# EAGLE design steering_wheel (EAGLE 5.06)
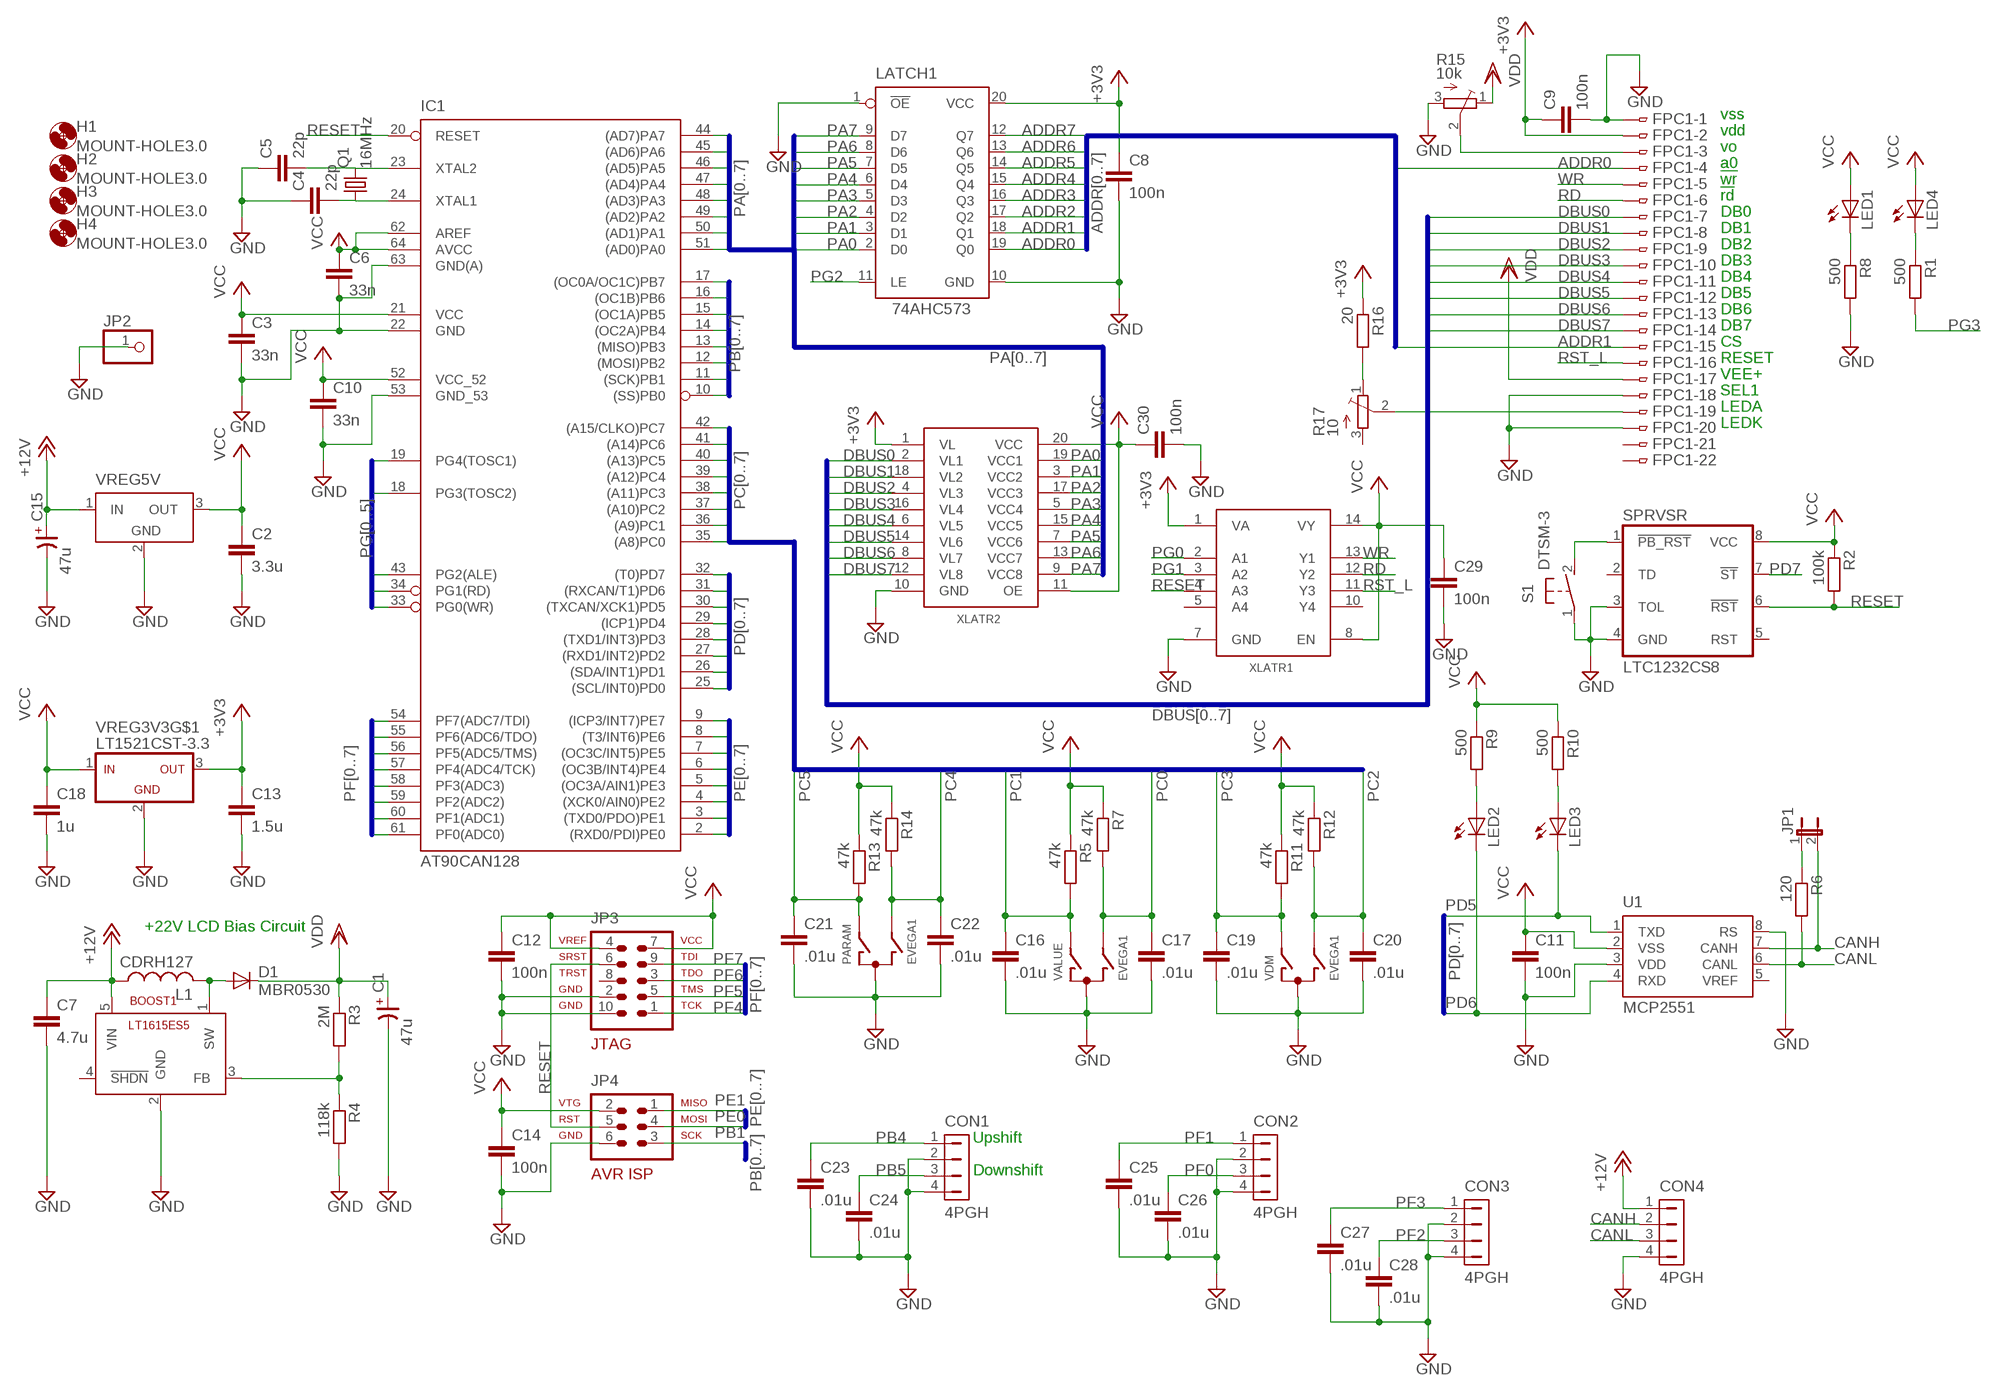
[diagram p0: schematic, sheet 1]

## Parts
BOOST1  LT1615ES5  [SOT23-5]
C1  47u  CP-SV-E/F  [SV-E/F]
C2  3.3u  C-EUC1206  [C1206]
C3  33n  C-EUC1206  [C1206]
C4  22p  C-EUC1206  [C1206]
C5  22p  C-EUC1206  [C1206]
C6  33n  C-EUC1206  [C1206]
C7  4.7u  C-EUC1206  [C1206]
C8  100n  C-EUC1206  [C1206]
C9  100n  C-EUC1206  [C1206]
C10  33n  C-EUC1206  [C1206]
C11  100n  C-EUC1206  [C1206]
C12  100n  C-EUC1206  [C1206]
C13  1.5u  C-EUC1206  [C1206]
C14  100n  C-EUC1206  [C1206]
C15  47u  CP-SV-E/F  [SV-E/F]
C16  .01u  C-EUC1206  [C1206]
C17  .01u  C-EUC1206  [C1206]
C18  1u  C-EUC1206  [C1206]
C19  .01u  C-EUC1206  [C1206]
C20  .01u  C-EUC1206  [C1206]
C21  .01u  C-EUC1206  [C1206]
C22  .01u  C-EUC1206  [C1206]
C23  .01u  C-EUC1206  [C1206]
C24  .01u  C-EUC1206  [C1206]
C25  .01u  C-EUC1206  [C1206]
C26  .01u  C-EUC1206  [C1206]
C27  .01u  C-EUC1206  [C1206]
C28  .01u  C-EUC1206  [C1206]
C29  100n  C-EUC1206  [C1206]
C30  100n  C-EUC1206  [C1206]
CON1  4PGH  [GH-CON-SIDE]
CON2  4PGH  [GH-CON-SIDE]
CON3  4PGH  [GH-CON-SIDE]
CON4  4PGH  [GH-CON-SIDE]
D1  MBR0530  DIODE-SOD123  [SOD123]
FPC1  FH12-22S-1SH(55)  [FH12-22S-1SH(56)]
H1  MOUNT-HOLE3.0  [3,0]
H2  MOUNT-HOLE3.0  [3,0]
H3  MOUNT-HOLE3.0  [3,0]
H4  MOUNT-HOLE3.0  [3,0]
IC1  AT90CAN128  [TQFP64]
JP1  JP1E  [JP1]
JP2  PINHD-1X1  [1X01]
JP3  AVR-JTAG-10  [AVR-JTAG-10]
JP4  AVR-ISP-6  [AVR-ISP-6]
L1  CDRH127  [CDRH127]
LATCH1  74AHC573  [SO20W]
LED1  LEDCHIPLED_1206  [CHIPLED_1206]
LED2  LEDCHIPLED_1206  [CHIPLED_1206]
LED3  LEDCHIPLED_1206  [CHIPLED_1206]
LED4  LEDCHIPLED_1206  [CHIPLED_1206]
PARAM  EVEGA1  [EVEGA1]
Q1  16MHz  CRYSTALHC49UP  [HC49UP]
R1  500  R-EU_R1206  [R1206]
R2  100k  R-EU_R1206  [R1206]
R3  2M  R-EU_R1206  [R1206]
R4  118k  R-EU_R1206  [R1206]
R5  47k  R-EU_R1206  [R1206]
R6  120  R-EU_R1206  [R1206]
R7  47k  R-EU_R1206  [R1206]
R8  500  R-EU_R1206  [R1206]
R9  500  R-EU_R1206  [R1206]
R10  500  R-EU_R1206  [R1206]
R11  47k  R-EU_R1206  [R1206]
R12  47k  R-EU_R1206  [R1206]
R13  47k  R-EU_R1206  [R1206]
R14  47k  R-EU_R1206  [R1206]
R15  10k  PVG3A  [PVG3A]
R16  20  R-EU_R1206  [R1206]
R17  10  PVG3A  [PVG3A]
S1  DTSM-3  [DTSM-3]
SPRVSR  LTC1232CS8  [SOIC8]
U1  MCP2551  [SOIC8]
VALUE  EVEGA1  [EVEGA1]
VDM  EVEGA1  [EVEGA1]
VREG3V3  LT1521CST-3.3  [SOT223]
VREG5V  LT1129CST5  [SOT223]
XLATR1  ADG3304  [TSSOP14]
XLATR2  ST2378E  [TSSOP20]

## Nets
+3V3: C8.1 C9.1 C13.1 FPC1.2 LATCH1.20(VCC) R16.1 VREG3V3.3(OUT) XLATR1.1(VA) XLATR2.1(VL)
+12V: BOOST1.5(VIN) C7.1 C15.+ CON4.1 L1.1 VREG5V.1(IN)
ADDR0: FPC1.4 LATCH1.19(Q0)
ADDR1: FPC1.15 LATCH1.18(Q1)
ADDR2: LATCH1.17(Q2)
ADDR3: LATCH1.16(Q3)
ADDR4: LATCH1.15(Q4)
ADDR5: LATCH1.14(Q5)
ADDR6: LATCH1.13(Q6)
ADDR7: LATCH1.12(Q7)
CANH: CON4.2 JP1.2 U1.7(CANH)
CANL: CON4.3 R6.2 U1.6(CANL)
DBUS0: FPC1.7 XLATR2.2(VL1)
DBUS1: FPC1.8 XLATR2.18(VL2)
DBUS2: FPC1.9 XLATR2.4(VL3)
DBUS3: FPC1.10 XLATR2.16(VL4)
DBUS4: FPC1.11 XLATR2.6(VL5)
DBUS5: FPC1.12 XLATR2.14(VL6)
DBUS6: FPC1.13 XLATR2.8(VL7)
DBUS7: FPC1.14 XLATR2.12(VL8)
GND: BOOST1.2(GND) C1.- C2.2 C3.2 C4.1 C5.1 C6.2 C7.2 C8.2 C9.2 C10.2 C11.2 C12.2 C13.2 C14.2 C15.- C16.2 C17.2 C18.2 C19.2 C20.2 C21.2 C22.2 C23.2 C24.2 C25.2 C26.2 C27.2 C28.2 C29.2 C30.2 CON1.2 CON1.4 CON2.2 CON2.4 CON3.2 CON3.4 CON4.4 FPC1.1 FPC1.18 FPC1.20 IC1.22(GND) IC1.53(GND_53) IC1.63(GND(A)) JP2.1 JP3.2 JP3.10 JP4.6 LATCH1.1(!OE) LATCH1.10(GND) PARAM.COM(C) R4.2 R8.2 R15.3(A) S1.1 SPRVSR.3(TOL) SPRVSR.4(GND) U1.3(VDD) U1.8(RS) VALUE.COM(C) VDM.COM(C) VREG3V3.2(GND) VREG5V.2(GND) XLATR1.7(GND) XLATR2.10(GND)
N$1: LED4.C R1.1
N$2: BOOST1.3(FB) R3.2 R4.1
N$3: BOOST1.1(SW) D1.A L1.2
N$4: C5.2 IC1.23(XTAL2) Q1.2
N$5: C4.2 IC1.24(XTAL1) Q1.1
N$6: FPC1.3 R15.2(S)
N$7: FPC1.19 R17.2(S)
N$8: R16.2 R17.1(E)
N$18: S1.2 SPRVSR.1(!PB_RST)
N$19: JP1.1 R6.1
N$20: LED1.C R8.1
N$21: LED2.A R9.2
N$23: LED3.A R10.2
PA0: IC1.51((AD0)PA0) LATCH1.2(D0) XLATR2.19(VCC1)
PA1: IC1.50((AD1)PA1) LATCH1.3(D1) XLATR2.3(VCC2)
PA2: IC1.49((AD2)PA2) LATCH1.4(D2) XLATR2.17(VCC3)
PA3: IC1.48((AD3)PA3) LATCH1.5(D3) XLATR2.5(VCC4)
PA4: IC1.47((AD4)PA4) LATCH1.6(D4) XLATR2.15(VCC5)
PA5: IC1.46((AD5)PA5) LATCH1.7(D5) XLATR2.7(VCC6)
PA6: IC1.45((AD6)PA6) LATCH1.8(D6) XLATR2.13(VCC7)
PA7: IC1.44((AD7)PA7) LATCH1.9(D7) XLATR2.9(VCC8)
PB0: IC1.10((SS)PB0)
PB1: IC1.11((SCK)PB1) JP4.3
PB2: IC1.12((MOSI)PB2)
PB3: IC1.13((MISO)PB3)
PB4: C23.1 CON1.1 IC1.14((OC2A)PB4)
PB5: C24.1 CON1.3 IC1.15((OC1A)PB5)
PB6: IC1.16((OC1B)PB6)
PB7: IC1.17((OC0A/OC1C)PB7)
PC0: C17.1 IC1.35((A8)PC0) R7.2 VALUE.B
PC1: C16.1 IC1.36((A9)PC1) R5.2 VALUE.A
PC2: C20.1 IC1.37((A10)PC2) R12.2 VDM.B
PC3: C19.1 IC1.38((A11)PC3) R11.2 VDM.A
PC4: C22.1 IC1.39((A12)PC4) PARAM.B R14.2
PC5: C21.1 IC1.40((A13)PC5) PARAM.A R13.2
PC6: IC1.41((A14)PC6)
PC7: IC1.42((A15/CLKO)PC7)
PD0: IC1.25((SCL/INT0)PD0)
PD1: IC1.26((SDA/INT1)PD1)
PD2: IC1.27((RXD1/INT2)PD2)
PD3: IC1.28((TXD1/INT3)PD3)
PD4: IC1.29((ICP1)PD4)
PD5: IC1.30((TXCAN/XCK1)PD5) LED3.C U1.1(TXD)
PD6: IC1.31((RXCAN/T1)PD6) LED2.C U1.4(RXD)
PD7: IC1.32((T0)PD7) SPRVSR.7(!ST)
PE0: IC1.2((RXD0/PDI)PE0) JP4.4
PE1: IC1.3((TXD0/PDO)PE1) JP4.1
PE2: IC1.4((XCK0/AIN0)PE2)
PE3: IC1.5((OC3A/AIN1)PE3)
PE4: IC1.6((OC3B/INT4)PE4)
PE5: IC1.7((OC3C/INT5)PE5)
PE6: IC1.8((T3/INT6)PE6)
PE7: IC1.9((ICP3/INT7)PE7)
PF0: C26.1 CON2.3 IC1.61(PF0(ADC0))
PF1: C25.1 CON2.1 IC1.60(PF1(ADC1))
PF2: C28.1 CON3.3 IC1.59(PF2(ADC2))
PF3: C27.1 CON3.1 IC1.58(PF3(ADC3))
PF4: IC1.57(PF4(ADC4/TCK)) JP3.1
PF5: IC1.56(PF5(ADC5/TMS)) JP3.5
PF6: IC1.55(PF6(ADC6/TDO)) JP3.3
PF7: IC1.54(PF7(ADC7/TDI)) JP3.9
PG0: IC1.33(PG0(WR)) XLATR1.2(A1)
PG1: IC1.34(PG1(RD)) XLATR1.3(A2)
PG2: IC1.43(PG2(ALE)) LATCH1.11(LE)
PG3: IC1.18(PG3(TOSC2)) R1.2
PG4: IC1.19(PG4(TOSC1))
RD: FPC1.6 XLATR1.12(Y2)
RESET: IC1.20(RESET) JP3.6 JP4.5 R2.2 SPRVSR.6(!RST) XLATR1.4(A3)
RST_L: FPC1.16 XLATR1.11(Y3)
VCC: C2.1 C3.1 C6.1 C10.1 C11.1 C12.1 C14.1 C18.1 C29.1 C30.1 IC1.21(VCC) IC1.52(VCC_52) IC1.62(AREF) IC1.64(AVCC) JP3.4 JP3.7 JP4.2 LED1.A LED4.A R2.1 R5.1 R7.1 R9.1 R10.1 R11.1 R12.1 R13.1 R14.1 SPRVSR.8(VCC) U1.2(VSS) VREG3V3.1(IN) VREG5V.3(OUT) XLATR1.8(EN) XLATR1.14(VY) XLATR2.11(OE) XLATR2.20(VCC)
VDD: C1.+ D1.C FPC1.17 R3.1 R15.1(E)
WR: FPC1.5 XLATR1.13(Y1)
Unconnected: BOOST1.4(!SHDN) FPC1.21 FPC1.22 JP3.8 R17.3(A) SPRVSR.2(TD) SPRVSR.5(RST) XLATR1.5(A4) XLATR1.10(Y4)

## Buses
PD[0..7]
PF[0..7]
PE[0..7]
PB[0..7]
PA[0..7]
PC[0..7]
PG[0..5]
ADDR[0..7]
DBUS[0..7]

## Notes on the sheet
- vss
- vdd
- vo
- a0
- !wr
- !rd
- DB0
- DB1
- DB2
- DB3
- DB4
- DB5
- DB6
- DB7
- CS
- RESET
- VEE+
- SEL1
- LEDA
- LEDK
- +22V LCD Bias Circuit
- Upshift
- Downshift

## Power pins joined to a net without a drawn wire
GND: VREG3V3.4(GND) VREG5V.4(GND)
VREF: U1.5(VREF)

## Library data of the parts
BOOST1 = linear_custom:LT1615
C1 C15 = cap-master:CP-: POLARIZED CAP
C2-C14 C16-C30 = resistor:C-EU: CAPACITOR, European symbol
CON1-CON4 = con-JST-GH-series:4PGH
D1 = diode:DIODE-: DIODE
FPC1 = con-hirose:FH12
H1-H4 = holes:MOUNT-HOLE: MOUNTING HOLE with drill center marker
IC1 = at90can128:AT90CAN128
JP1 = jumper:JP1E: JUMPER
JP2 = pinhead:PINHD-1X1: PIN HEADER
JP3 = atmel:AVR-JTAG-10: AVR JTAG Debug/Programming Header
JP4 = atmel:AVR-ISP-6: AVR ISP-6 Serial Programming Header
L1 = cdrh127:CDRH127: Sumida Power Inductor
LATCH1 = 74AHC573:74AHC573
LED1-LED4 = led:LED: LED OSRAM: - CHIPLED LG R971, LG N971, LY N971, LG Q971, LY Q971, LO R971, LY R971 LH N974, LH R974 LS Q976, LO Q976, LY Q976 LO Q996 - Hyper CHIPLED LW Q18S LB Q993, LB Q99A, LB R99A - SideLED LS A670, LO A670, LY A670, LG A670, LP A670 LB A673, LV A673, LT A673, LW A673 LH A674 LY A675 LS A676, LA A676, LO A676, LY A676, LW A676 LS A679, LY A679, LG A679 - Hyper Micro SIDELED® LS Y876, LA Y876, LO Y876, LY Y876 LT Y87S - SmartLED LW L88C, LW L88S LB L89C, LB L89S, LG L890 LS L89K, LO L89K, LY L89K LS L896, LA L896, LO L896, LY L896 - TOPLED LS T670, LO T670, LY T670, LG T670, LP T670 LSG T670, LSP T670, LSY T670, LOP T670, LYG T670 LG T671, LOG T671, LSG T671 LB T673, LV T673, LT T673, LW T673 LH T674 LS T676, LA T676, LO T676, LY T676, LB T676, LH T676, LSB T676, LW T676 LB T67C, LV T67C, LT T67C, LS T67K, LO T67K, LY T67K, LW E67C LS E67B, LA E67B, LO E67B, LY E67B, LB E67C, LV E67C, LT E67C LW T67C LS T679, LY T679, LG T679 LS T770, LO T770, LY T770, LG T770, LP T770 LB T773, LV T773, LT T773, LW T773 LH T774 LS E675, LA E675, LY E675, LS T675 LS T776, LA T776, LO T776, LY T776, LB T776 LHGB T686 LT T68C, LB T68C - Hyper Mini TOPLED® LB M676 - Mini TOPLED Santana® LG M470 LS M47K, LO M47K, LY M47K Source: http://www.osram.convergy.de LUXEON: - LUMILED® LXK2-PW12-R00, LXK2-PW12-S00, LXK2-PW14-U00, LXK2-PW14-V00 LXK2-PM12-R00, LXK2-PM12-S00, LXK2-PM14-U00 LXK2-PE12-Q00, LXK2-PE12-R00, LXK2-PE12-S00, LXK2-PE14-T00, LXK2-PE14-U00 LXK2-PB12-K00, LXK2-PB12-L00, LXK2-PB12-M00, LXK2-PB14-N00, LXK2-PB14-P00, LXK2-PB14-Q00 LXK2-PR12-L00, LXK2-PR12-M00, LXK2-PR14-Q00, LXK2-PR14-R00 LXK2-PD12-Q00, LXK2-PD12-R00, LXK2-PD12-S00 LXK2-PH12-R00, LXK2-PH12-S00 LXK2-PL12-P00, LXK2-PL12-Q00, LXK2-PL12-R00 Source: www.luxeon.com KINGBRIGHT: KA-3528ASYC Source: www.kingbright.com
PARAM VALUE VDM = panasonic-encoder:EVEGA1
Q1 = crystal:CRYSTAL: CRYSTAL
R1-R14 R16 = rcl:R-EU_: RESISTOR, European symbol
R15 R17 = pots:PVG
S1 = switch-tact:DTSM-3
SPRVSR = linear:LTC1232: Microprocessor Supervisory Circuit
U1 = MCP2551:MCP2551
VREG3V3 = linear-technology-2:LT1521: 300mA Low Dropout Regulators with Micropower Quiescent Current
VREG5V = linear-technology:LT1129CST5: VOLTAGE REGULATOR with shutdown
XLATR1 = translators:ADG3304
XLATR2 = stmicro_extra_lib:ST2378E

## Board
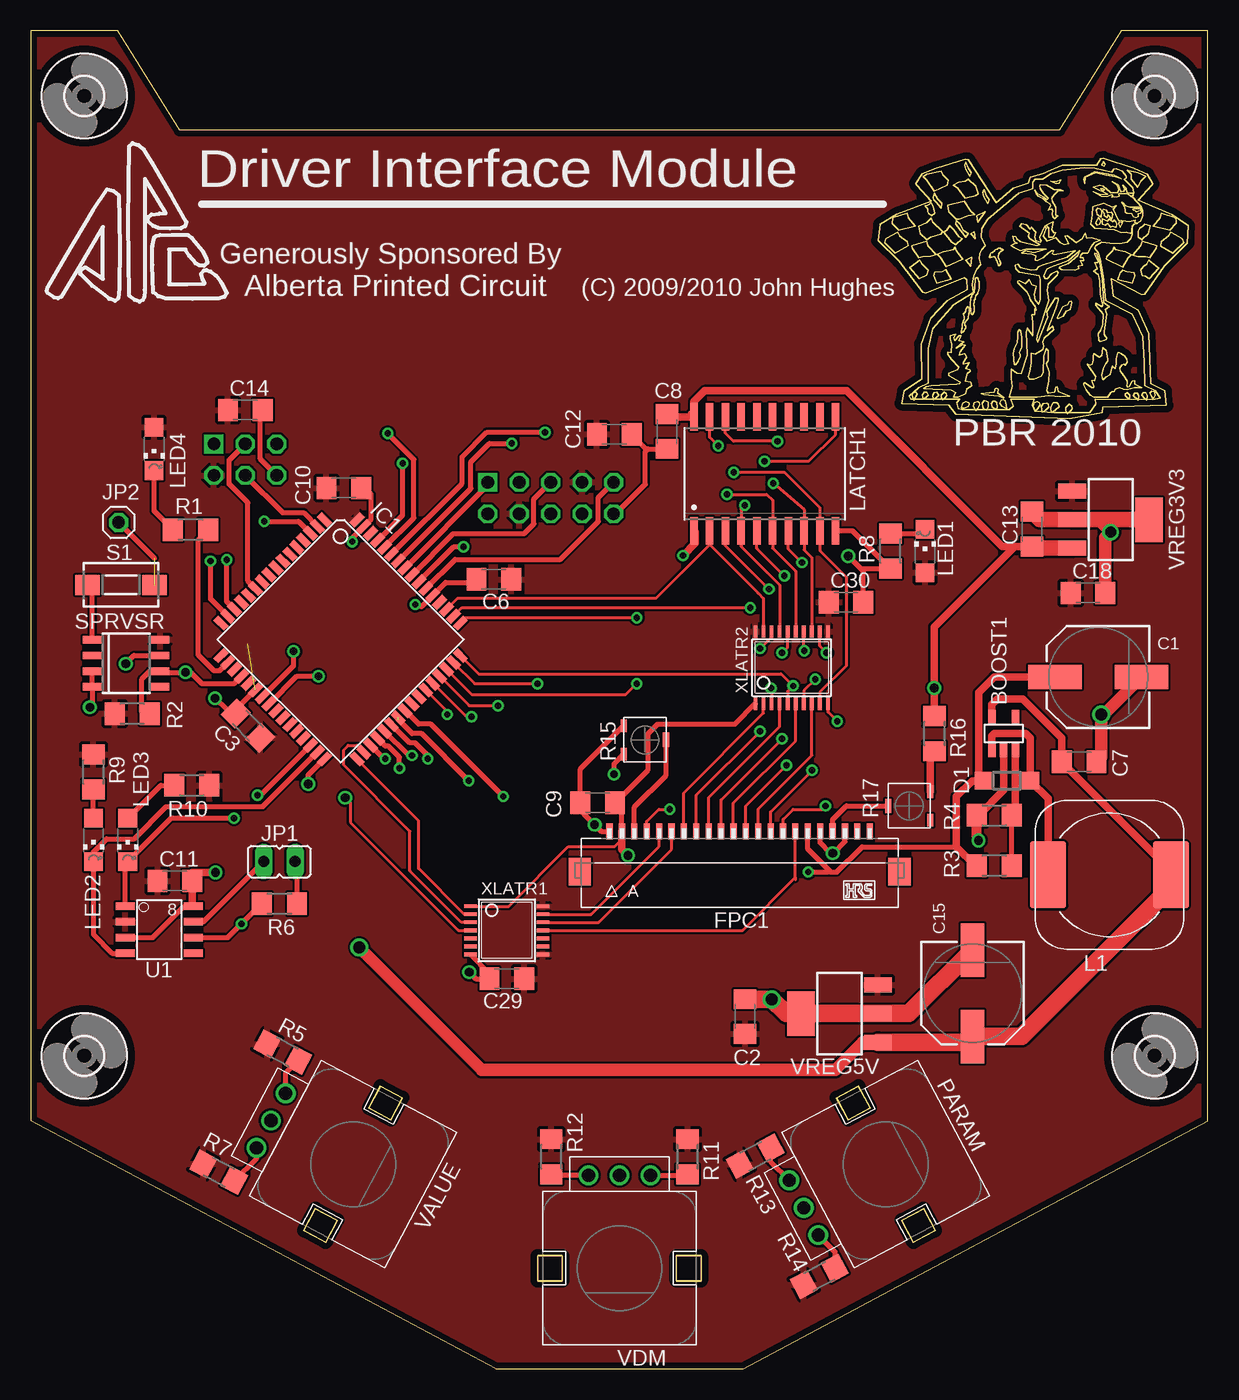
[diagram p1: board, top side]
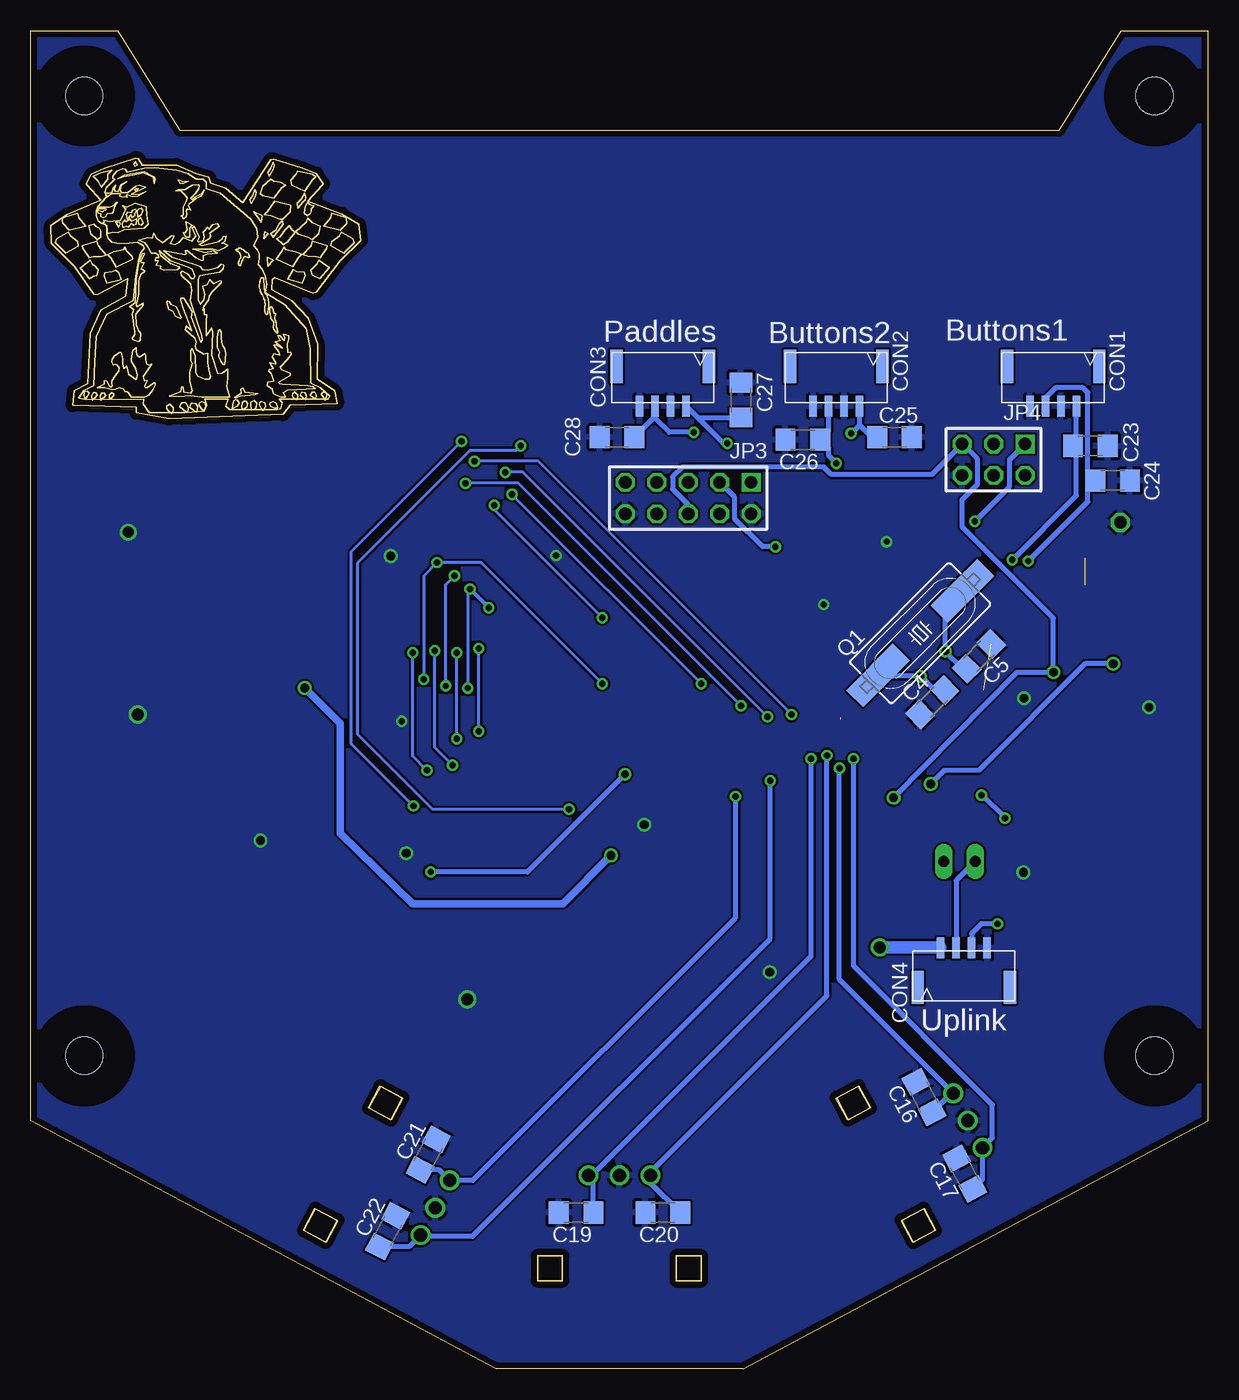
[diagram p2: board, bottom side, seen from below]

Size 95 x 108 mm. Coordinates in mm from the lower left corner, seen from the top.
Outline: 1234 segments
Copper layers (1*16): Top 0.035mm / dielectric 1.5mm / Bottom 0.035mm
Design rules "APCircuits": minimum track width 7mil, minimum drill 16mil, track to track 7mil, track to pad 7mil, pad to pad 7mil, via to via 7mil, smd to smd 7mil, copper to edge 20mil, drill to drill 7mil, minimum pad ring 10mil, minimum via ring 8mil, stop-mask expansion 4mil, vias tented up to drill 0mil, thermal gap 10mil

### Footprints (pad centres in the part's own frame; a part is rotated, then mirrored left to right if it is on the bottom)
SOT23-5 = smd 0.6 x 1.2: 1 -0.95,-1.306; 2 0,-1.306; 3 0.95,-1.306; 4 0.95,1.306; 5 -0.95,1.306
SV-E/F = smd 4.318 x 1.93: + -3.493,0; - 3.493,0
C1206 = smd 1.6 x 1.8: 1 -1.4,0; 2 1.4,0
GH-CON-SIDE = smd 0.6 x 1.7: 1 -1.875,2.275; 2 -0.625,2.275; 3 0.625,2.275; 4 1.875,2.275 | smd 1 x 2.7: P$5 3.725,-0.925; P$6 -3.725,-0.925
SOD123 = smd 1.4 x 1.4: A 1.9,0; C -1.9,0
FH12-22S-1SH(56) = smd 0.5 x 1.3: 1 -10.5,4.77; 2 -9.5,4.77; 3 -8.5,4.77; 4 -7.5,4.77; 5 -6.5,4.77; 6 -5.5,4.77; 7 -4.5,4.77; 8 -3.5,4.77; 9 -2.5,4.77; 10 -1.5,4.77; 11 -0.5,4.77; 12 0.5,4.77; 13 1.5,4.77; 14 2.5,4.77; 15 3.5,4.77; 16 4.5,4.77; 17 5.5,4.77; 18 6.5,4.77; 19 7.5,4.77; 20 8.5,4.77; 21 9.5,4.77; 22 10.5,4.77 | smd 1.8 x 2.2: M1 12.9,1.52; M2 -12.9,1.52
3,0 = hole 3: 0,0
TQFP64 = smd 1.194 x 0.559: 1 -7.76,5.905; 2 -7.76,5.118; 3 -7.76,4.331; 4 -7.76,3.543; 5 -7.76,2.756; 6 -7.76,1.968; 7 -7.76,1.181; 8 -7.76,0.394; 9 -7.76,-0.394; 10 -7.76,-1.181; 11 -7.76,-1.968; 12 -7.76,-2.756; 13 -7.76,-3.543; 14 -7.76,-4.331; 15 -7.76,-5.118; 16 -7.76,-5.905; 33 7.76,-5.905; 34 7.76,-5.118; 35 7.76,-4.331; 36 7.76,-3.543; 37 7.76,-2.756; 38 7.76,-1.968; 39 7.76,-1.181; 40 7.76,-0.394; 41 7.76,0.394; 42 7.76,1.181; 43 7.76,1.968; 44 7.76,2.756; 45 7.76,3.543; 46 7.76,4.331; 47 7.76,5.118; 48 7.76,5.905 | smd 0.559 x 1.194: 17 -5.905,-7.76; 18 -5.118,-7.76; 19 -4.331,-7.76; 20 -3.543,-7.76; 21 -2.756,-7.76; 22 -1.968,-7.76; 23 -1.181,-7.76; 24 -0.394,-7.76; 25 0.394,-7.76; 26 1.181,-7.76; 27 1.968,-7.76; 28 2.756,-7.76; 29 3.543,-7.76; 30 4.331,-7.76; 31 5.118,-7.76; 32 5.905,-7.76; 49 5.905,7.76; 50 5.118,7.76; 51 4.331,7.76; 52 3.543,7.76; 53 2.756,7.76; 54 1.968,7.76; 55 1.181,7.76; 56 0.394,7.76; 57 -0.394,7.76; 58 -1.181,7.76; 59 -1.968,7.76; 60 -2.756,7.76; 61 -3.543,7.76; 62 -4.331,7.76; 63 -5.118,7.76; 64 -5.905,7.76
JP1 = drill 0.914 long: 1 0,-1.27; 2 0,1.27
1X01 = drill 1.016 octagon: 1 0,0
AVR-JTAG-10 = drill 1.016 square: 1 -5.08,-1.27 | drill 1.016 octagon: 2 -5.08,1.27; 3 -2.54,-1.27; 4 -2.54,1.27; 5 0,-1.27; 6 0,1.27; 7 2.54,-1.27; 8 2.54,1.27; 9 5.08,-1.27; 10 5.08,1.27
AVR-ISP-6 = drill 1.016 square: 1 -2.54,-1.27 | drill 1.016 octagon: 2 -2.54,1.27; 3 0,-1.27; 4 0,1.27; 5 2.54,-1.27; 6 2.54,1.27
CDRH127 = smd 5.4 x 2.9: 1 0,4.95; 2 0,-4.95
SO20W = smd 0.6 x 2.2: 1 -5.715,-4.6; 2 -4.445,-4.6; 3 -3.175,-4.6; 4 -1.905,-4.6; 5 -0.635,-4.6; 6 0.635,-4.6; 7 1.905,-4.6; 8 3.175,-4.6; 9 4.445,-4.6; 10 5.715,-4.6; 11 5.715,4.6; 12 4.445,4.6; 13 3.175,4.6; 14 1.905,4.6; 15 0.635,4.6; 16 -0.635,4.6; 17 -1.905,4.6; 18 -3.175,4.6; 19 -4.445,4.6; 20 -5.715,4.6
CHIPLED_1206 = smd 1.5 x 1.5: A 0,-1.75; C 0,1.75
EVEGA1 = drill 1.067 round: A -2.5,-7.5; B 2.5,-7.5; COM 0,-7.5
HC49UP = smd 5.334 x 1.93: 1 -4.826,0; 2 4.826,0
R1206 = smd 1.6 x 1.803: 1 -1.422,0; 2 1.422,0
PVG3A = smd 1 x 0.5: 1 1.15,-1.7; 3 -1.15,-1.7 | smd 1.15 x 0.5: 2 0,1.7
DTSM-3 = smd 2 x 1.6: 1 -2.7,0; 2 2.7,0
SOIC8 = smd 0.6 x 1.5: 1 -1.905,-2.75; 2 -0.635,-2.75; 3 0.635,-2.75; 4 1.905,-2.75; 5 1.905,2.75; 6 0.635,2.75; 7 -0.635,2.75; 8 -1.905,2.75
SOIC8' = smd 0.61 x 1.524: 1 -2.54,-2.743; 2 -1.27,-2.743; 3 0,-2.743; 4 1.27,-2.743; 5 1.27,2.743; 6 0,2.743; 7 -1.27,2.743; 8 -2.54,2.743
SOT223 = smd 1.219 x 2.235: 1 -2.311,-3.099; 2 0,-3.099; 3 2.311,-3.099 | smd 3.6 x 2.2: 4 0,3.099
TSSOP14 = smd 0.305 x 0.991: 1 -1.95,-2.918; 2 -1.3,-2.918; 3 -0.65,-2.918; 4 0,-2.918; 5 0.65,-2.918; 6 1.3,-2.918; 7 1.95,-2.918; 8 1.95,2.918; 9 1.3,2.918; 10 0.65,2.918; 11 0,2.918; 12 -0.65,2.918; 13 -1.3,2.918; 14 -1.95,2.918
TSSOP20 = smd 0.305 x 0.991: 1 -2.925,-2.918; 2 -2.275,-2.918; 3 -1.625,-2.918; 4 -0.975,-2.918; 5 -0.325,-2.918; 6 0.325,-2.918; 7 0.975,-2.918; 8 1.625,-2.918; 9 2.275,-2.918; 10 2.925,-2.918; 11 2.925,2.918; 12 2.275,2.918; 13 1.625,2.918; 14 0.975,2.918; 15 0.325,2.918; 16 -0.325,2.918; 17 -0.975,2.918; 18 -1.625,2.918; 19 -2.275,2.918; 20 -2.925,2.918

### Placement (x,y rotation side)
BOOST1  78.51,51.27 0 top
C1  86.13,55.84 0 top
C2  57.64,28.42 90 top
C3  17.51,51.91 135 top
C4  22.26,53.8 45 bottom
C5  18.49,57.5 225 bottom
C6  37.36,63.72 180 top
C7  84.61,48.99 0 top
C8  51.33,75.66 270 top
C9  45.75,45.68 180 top
C10  25.25,71.1 0 top
C11  11.62,39.37 0 top
C12  47.09,75.43 0 top
C13  80.8,67.78 90 top
C14  17.3,77.39 0 top
C15  76,30.3 90 top
C16  22.92,21.92 118 bottom
C17  19.64,15.73 118 bottom
C18  85.32,62.62 0 top
C19  51,12.6 180 bottom
C20  44,12.6 180 bottom
C21  62.94,17.27 62 bottom
C22  66.22,11.08 62 bottom
C23  9.5,74.5 0 bottom
C24  7.7,71.7 0 bottom
C25  25.3,75.2 0 bottom
C26  32.7,75 180 bottom
C27  37.7,78.2 90 bottom
C28  47.7,75.2 180 bottom
C29  38.4,31.47 180 top
C30  65.79,61.87 0 top
CON1  12.5,80 180 bottom
CON2  30,80 180 bottom
CON3  44,80 180 bottom
CON4  19.7,31.7 0 bottom
D1  78.77,47.46 0 top
FPC1  57.2,38.6 0 top
H1  90.7,102.75 0 top
H2  4.3,102.75 0 top
H3  90.7,25.25 0 top
H4  4.3,25.25 0 top
IC1  24.99,58.88 315 top
JP1  20.05,40.94 90 top
JP2  7.07,68.32 0 top
JP3  41.95,70.29 180 bottom
JP4  17.3,73.39 180 bottom
L1  87.05,39.86 270 top
LATCH1  59.22,72.24 0 top
LED1  72.16,66 0 top
LED2  5.05,42.68 180 top
LED3  7.81,42.68 180 top
LED4  9.94,74.26 180 top
PARAM  69,16.5 298 top
Q1  23.22,59.38 45 bottom
R1  12.88,67.72 0 top
R2  8.18,52.87 0 top
R3  77.75,40.6 0 top
R4  77.75,44.67 180 top
R5  20.33,25.56 332 top
R6  20.05,37.54 180 top
R7  15.16,15.85 332 top
R8  69.37,66 270 top
R9  5.04,48.17 270 top
R10  12.98,47.1 180 top
R11  53,17.1 270 top
R12  42,17.1 270 top
R13  58.47,17.15 28 top
R14  63.63,7.44 28 top
R15  49.56,50.76 270 top
R16  72.92,51.27 270 top
R17  70.89,45.43 90 top
S1  7.26,63.27 180 top
SPRVSR  7.68,56.94 270 top
U1  MCP2551  [SOIC8']  10.35,34.8 270 top
VALUE  26,16.5 242 top
VDM  47.5,8.1 180 top
VREG3V3  87.15,68.54 270 top
VREG5V  65.26,28.66 90 top
XLATR1  38.4,35.38 270 top
XLATR2  61.4,56.6 0 top

### Tracks (layer width: path | path; a pad name or v marks a point on that pad's centre or on a via)
+3V3  (via drill 0.71)
  Top 0.254: FPC1.2 47.65,43.32 47.65,42.67 47.12,42.14 43.38,42.14 38.58,37.33 XLATR1.1
  Top 0.406: FPC1.2 47.7,45.38 C9.1 49.81,48.35 49.81,51.27 50.57,52.03 56.83,52.03 XLATR2.1
  Top 0.61: LATCH1.20 53.51,78.08 54.38,78.96 65.83,78.96 78.4,66.38 79.4,66.38 | LATCH1.20 53.29,77.06 | C8.1 51.55,76.84 LATCH1.20 | 79.4,66.38 C13.1 | 79.4,66.38 72.9,59.88 v72.9,54.94 72.92,54.91 R16.1 | v48.18,41.43 47.7,41.91 FPC1.2
  Top 0.813: C13.1 80.67,66.26
  Top 1.27: 80.95,66.23 80.54,66.23 | 80.95,66.23 VREG3V3.3 | C13.1 80.95,66.23
  Bottom 0.61: v72.9,54.94 70.05,52.09 70.05,43.2 64.19,37.52 52.09,37.52 v48.18,41.43
+12V  (via drill 0.97)
  Top 0.61: BOOST1.5 77.56,53.62 78,54.07 80.04,54.07 83.21,50.89 C7.1 92,40.19 L1.1 | 67.14,26.34 VREG5V.1
  Top 1.016: v26.5,34 36.4,24.1 64.9,24.1 67.14,26.34
  Top 1.422: C15.+ 75.93,26.75 | VREG5V.1 75.53,26.34 C15.+ | C15.+ 79.95,26.81 92,38.86 L1.1
  Bottom 0.61: CON4.1 21.6,34
  Bottom 1.016: 21.6,34 v26.5,34
ADDR0  (via drill 0.51)
  Top 0.254: v55.47,74.5 54.78,75.19 LATCH1.19 | FPC1.4 49.7,44.19 50.67,45.16 v51.56,45.16
  Bottom 0.254: v55.47,74.5 55.83,74.14 59.56,74.14 68.63,65.08 68.63,51.21 62.59,45.16 v51.56,45.16
ADDR1  (via drill 0.51)
  Top 0.254: LATCH1.18 56.05,75.52 56.7,74.87 v60.25,74.87 | FPC1.15 60.7,44.34 61.52,45.16 63.87,45.16 v64.14,45.43
  Bottom 0.254: v64.14,45.43 69.14,50.43 69.14,65.98 v60.25,74.87
CANH
  Top 0.406: U1.7 13.91,36.07 JP1.2
  Bottom 0.406: CON4.2 20.32,39.4 JP1.2
CANL  (via drill 0.51)
  Top 0.406: U1.6 15.89,34.8 v16.99,35.9 R6.2
  Bottom 0.406: CON4.3 19.07,35.12 18.3,35.9 v16.99,35.9
DBUS0
  Top 0.254: FPC1.7 52.7,46.49 59.12,52.92 XLATR2.2
DBUS1  (via drill 0.51)
  Top 0.254: FPC1.8 53.7,46.3 v58.85,51.45 | XLATR2.18 59.77,59.06 v58.85,58.14
  Bottom 0.254: v58.85,51.45 58.85,57.96 v58.85,58.14
DBUS2
  Top 0.254: FPC1.9 54.7,46.1 60.42,51.83 XLATR2.4
DBUS3  (via drill 0.51)
  Top 0.254: XLATR2.16 61.08,58.23 v60.63,57.78 | FPC1.10 55.7,45.92 v60.63,50.85
  Bottom 0.254: v60.63,50.85 v60.63,57.78
DBUS4
  Top 0.254: XLATR2.6 61.73,50.69 56.7,45.66 FPC1.11
DBUS5  (via drill 0.51)
  Top 0.254: XLATR2.14 62.38,58.29 v62.41,57.96 | FPC1.12 57.7,45.43 v60.98,48.72
  Bottom 0.254: v62.41,57.96 62.41,50.14 v60.98,48.72
DBUS6
  Top 0.254: XLATR2.8 63.02,49.5 58.7,45.18 FPC1.13
DBUS7  (via drill 0.51)
  Top 0.254: XLATR2.12 63.67,58.34 v64.19,57.78 | FPC1.14 59.7,44.96 v63.04,48.3
  Bottom 0.254: v64.19,57.78 64.19,49.44 v63.04,48.3
GND  (via drill 0.51, 0.71, 0.89, 0.97)  (2 unrouted)
  Top 0.254: XLATR2.10 64.34,53.7 64.34,53.01 v65.08,52.27
  Top 0.406: 53.62,67.53 LATCH1.1 | v25.93,66.77 25.93,67.06 IC1.63 27.46,68.59 27.46,70.58 27.18,70.85 C10.2 | v31.01,61.69 31.52,61.52 IC1.53 33.47,63.46 35.71,63.46 C6.2 | U1.3 9.84,34.8 12.38,37.34 U1.8 | FPC1.1 46.03,43.37 v45.49,43.91 44.6,44.8 C9.2 44.35,48.4 R15.3 | FPC1.20 65.7,42.52 64.78,41.6 v64.72,41.6 64.56,41.6 63.7,42.46 FPC1.18 | IC1.22 16.52,53.19 C3.2 16.28,52.8 15.9,53.13 v14.85,54.13 | SPRVSR.3 SPRVSR.4 4.93,53.56 v4.76,53.39 | JP2.1 9.96,65.43 | 49.8,74.26 49.66,74.26 C12.2 | 49.8,74.26 C8.2 | JP3.10 47.22,69.02 49.6,71.4 49.6,74.06 49.8,74.26 | JP4.6 18.52,73.43 18.52,77.21 C14.2 | LATCH1.10 66.31,67.64 R8.2 66.99,64.58 v65.96,65.61 67.19,64.39 C30.2 | XLATR1.7 37.01,31.91 C29.2 35.92,31.47 v35.38,32
  Top 0.61: U1.8 13.02,37.41 C11.2 13.02,40.07 v14.9,40.05 | R4.2 76.48,44.67 78.51,46.7 BOOST1.2 | 53.62,67.53 53.62,66.64 v52.63,65.65
  Top 0.813: R4.2 76.33,43.04 v76.48,42.64
  Top 1.016: VREG3V3.2 86.13,68.54 v87.15,67.53 86.72,67.1 C18.2 | C1.- 86.58,52.8 v86.39,52.8 86.39,49.36 C7.2
  Top 1.27: VREG3V3.4 VREG3V3.2 81.44,68.54 C13.2
  Top 1.422: PARAM.COM 62.41,12.99 | C15.- 70.86,28.66 VREG5V.2 VREG5V.4 60.94,28.66 v59.8,29.8 59.78,29.82 C2.2
  Bottom 0.406: v35.38,32 35.2,32
  pour Bottom: 0,20 37.5,0 57.5,0 95,20 95,108 88,108 83,100 12,100 7,108 0,108
N$1
  Top 0.406: LED4.C 9.94,69.24 R1.1
N$2
  Top 0.406: R3.2 R4.1
  Top 0.61: BOOST1.3 79.46,44.96 R4.1
N$3
  Top 0.61: BOOST1.1 77.56,51.08 77.75,51.27 80.29,51.27 80.67,50.9 D1.A 82.1,46.03 L1.2 83.01,39.95
N$4  (via drill 0.6)
  Top 0.406: IC1.23 21.2,56.76 v21.2,57.9
  Bottom 0.406: C5.2 19.81,56.51 v21.2,57.9 21.2,61.4 Q1.2
N$5  (via drill 0.6)
  Top 0.406: IC1.24 21.45,55.9 v23.2,55.9
  Bottom 0.406: C4.2 22.09,54.79 v23.2,55.9 26.57,55.9 Q1.1
N$6
  Top 0.406: FPC1.3 48.7,45.34 51.26,47.89 R15.2
N$7
  Top 0.406: FPC1.19 64.7,44.32 65.81,45.43 R17.2
N$8
  Top 0.61: R17.1 72.59,49.52 R16.2
N$12
  pour Top: 74.65,77.57 86.84,77.57 87.1,77.83 90.91,77.83 91.16,78.08 91.16,78.59 90.65,79.1 90.4,79.1 89.89,79.6 89.89,83.67 89.64,83.92 89.38,83.92 87.6,85.7 86.84,86.21 86.08,86.97 86.08,90.53 86.33,90.78 88.11,90.78 89.64,92.3 89.64,94.08 87.1,96.62 82.52,96.62 81.25,95.35 80.24,95.35 76.68,91.8 76.68,91.29 76.17,90.78 76.17,87.48 72.36,83.67 72.36,82.65 72.11,79.86 71.09,79.1 71.09,78.84 71.6,78.33 73.89,78.33
N$18
  Top 0.406: SPRVSR.1 4.93,62.91 S1.2
N$19
  Top 0.406: R6.1 21.47,40.79 JP1.1
N$20
  Top 0.406: R8.1 71.83,67.43 LED1.C
N$21
  Top 0.406: LED2.A R9.2
N$23
  Top 0.406: R10.2 10.48,47.1 LED3.A
PA0
  Top 0.254: 54.78,66.52 LATCH1.2 | 54.78,66.52 58.69,62.61 59.12,62.17 XLATR2.19 | IC1.51 34.43,62.19 36.09,62.19 50.45,62.19 54.78,66.52
PA1  (via drill 0.51)
  Top 0.254: LATCH1.3 56.05,66.45 57.42,65.08 v59.56,62.94 | IC1.50 34.78,61.43 v58.05,61.43 | XLATR2.3 59.77,54.8 v59.74,54.94
  Bottom 0.254: v59.74,54.94 59.74,62.76 v59.56,62.94
  Bottom 0.305: v58.05,61.43 v59.56,62.94
PA2  (via drill 0.51)
  Top 0.254: 57.32,66.38 LATCH1.4 | XLATR2.17 60.42,63.27 57.32,66.38 | IC1.49 35.09,60.63 v48.9,60.63 | 57.32,66.38 57.32,69.41 v57.61,69.7
  Bottom 0.254: v57.61,69.7 57.61,69.34 v48.9,60.63
PA3  (via drill 0.51)
  Top 0.254: IC1.48 36.12,56.1 60.54,56.1 v61.52,55.12 61.08,54.67 XLATR2.5 | v60.81,64.01 58.59,66.23 LATCH1.5
  Bottom 0.254: v61.52,55.12 61.52,63.3 v60.81,64.01
PA4  (via drill 0.51)
  Top 0.254: XLATR2.15 61.73,64.38 59.86,66.24 LATCH1.6 59.86,70.11 59.38,70.59 v56.19,70.59 | IC1.47 35.81,55.3 v40.89,55.3
  Bottom 0.254: v40.89,55.3 v56.19,70.59
PA5  (via drill 0.51)
  Top 0.254: LATCH1.7 61.13,66.17 v62.23,65.08 | XLATR2.7 62.38,54.73 v63.3,55.65 | IC1.46 35.59,54.41 48.01,54.41 v48.9,55.3
  Bottom 0.254: v63.3,55.65 63.3,64.01 v62.23,65.08 58.67,65.08 v48.9,55.3
PA6  (via drill 0.51)
  Top 0.254: XLATR2.13 63.02,65.47 62.4,66.1 LATCH1.8 62.4,69.35 v59.92,71.48 | IC1.45 35.36,53.52 v37.69,53.52
  Bottom 0.254: v37.69,53.52 55.65,71.48 v59.92,71.48
PA7  (via drill 0.51)
  Top 0.254: XLATR2.9 63.67,54.61 65.79,56.72 65.79,63.91 63.67,66.03 LATCH1.9 63.67,69.5 60.81,72.36 v56.72,72.36 | IC1.44 35.14,52.63 v35.56,52.63
  Bottom 0.254: v35.56,52.63 55.3,72.36 v56.72,72.36
PB1
  Top 0.406: IC1.11 17.5,63.59 17.5,69.9 16,71.4 16,73.36 JP4.3
PB4  (via drill 0.51)
  Top 0.406: IC1.14 15.8,61.95 v15.8,65.3
  Bottom 0.406: v15.8,65.3 10.62,70.47 10.62,74.22 C23.1 10.62,74.78 CON1.1
PB5  (via drill 0.51)
  Top 0.406: IC1.15 14.5,62.13 v14.5,65.2
  Bottom 0.406: v14.5,65.2 9.7,70 9.7,71.1 C24.1 9.7,72.3 9.7,78.8 10.1,79.2 12.3,79.2 13.12,78.38 CON1.3
PC0  (via drill 0.51)
  Top 0.406: IC1.35 27.41,50.3 28.47,49.24 v28.6,49.24 | R7.2 18.2,16.96 VALUE.B
  Bottom 0.406: C17.1 18.2,15.27 VALUE.B 17.4,18.62 17.4,21.3 28.6,32.5 v28.6,49.24
PC1  (via drill 0.51)
  Top 0.406: IC1.36 28.6,50.26 28.86,50.26 29.74,49.37 v29.74,48.48 | R5.2 20.55,23.86 VALUE.A
  Bottom 0.406: 29.74,48.31 v29.74,48.48 29.74,31.42 VALUE.A 20.72,22.23 C16.1
PC2  (via drill 0.51)
  Top 0.406: IC1.37 30.48,49.49 v30.76,49.49 | R12.2 42.08,15.6 VDM.B
  Bottom 0.406: v30.76,49.49 30.76,30.1 45,15.86 VDM.B 45,15 C20.1
PC3  (via drill 0.51)
  Top 0.406: IC1.38 30.58,50.51 31.01,50.51 32.03,49.49 v32.03,49.24 | R11.2 52.92,15.6 VDM.A
  Bottom 0.406: C19.1 49.6,15.2 VDM.A 49.73,15.6 32.03,33.3 v32.03,49.24
PC4  (via drill 0.51)  (1 unrouted)
  Top 0.406: 29.64,52.39 30.76,51.27 31.52,51.27 v35.33,47.46 | R14.2 64.89,9.44 PARAM.B
  Bottom 0.406: v35.33,47.46 35.33,34.7 59.37,10.66 63.44,10.66 PARAM.B 64.47,9.85 C22.1
PC5  (via drill 0.51)
  Top 0.406: IC1.40 31.28,52.03 32.28,52.03 v38.13,46.19 | R13.2 59.72,16.67 PARAM.A
  Bottom 0.406: v38.13,46.19 38.13,36.4 59.34,15.19 PARAM.A 62.05,16.03 C21.1
PD5  (via drill 0.51)
  Top 0.406: U1.1 7.61,40.47 LED3.C 11.32,44.44 v16.38,44.44 | v18.29,46.29 18.52,46.29 IC1.30
  Bottom 0.406: v16.38,44.44 18.23,46.29 v18.29,46.29
PD6
  Top 0.406: U1.4 6.54,33.53 5.05,35.02 LED2.C 5.05,41.73 6.1,42.78 8.33,42.78 10.92,45.37 18.71,45.37 IC1.31
PD7  (via drill 0.71)
  Top 0.406: SPRVSR.7 8.31,57.57 v7.65,56.91 | IC1.32 22.38,47.92 v22.38,47.21
  Bottom 0.406: v7.65,56.91 9.89,56.91 18.5,48.3 21.29,48.3 v22.38,47.21
PE0
  Top 0.406: IC1.2 22.01,69.1 20.31,69.1 JP4.4
PE1  (via drill 0.51)
  Top 0.406: IC1.3 21.59,68.4 v18.82,68.4
  Bottom 0.406: v18.82,68.4 16,71.22 16,73.4 14.76,74.64 JP4.1
PF0  (via drill 0.51)
  Top 0.406: IC1.61 30,68.9 v30,73.1
  Bottom 0.406: v30,73.1 30.62,73.72 30.62,74.33 C26.1 30.62,75.67 CON2.3
PF1  (via drill 0.51)
  Top 0.406: IC1.60 30.9,68.69 30.9,73.4 v28.8,75.5
  Bottom 0.406: v28.8,75.5 28.12,76.17 | 28.12,76.17 CON2.1 | C25.1 27.15,75.2 28.12,76.17
PF2  (via drill 0.51)
  Top 0.406: IC1.59 34.8,71.47 34.8,73.6 36.8,75.6 v41.5,75.6
  Bottom 0.406: v41.5,75.6 43.5,75.6 44.6,76.7 | 44.6,76.7 44.6,77.7 CON3.3 | 44.6,76.7 44.8,76.7 C28.1
PF3  (via drill 0.51)
  Top 0.406: IC1.58 35.5,71.06 35.5,73.2 37,74.7 v38.8,74.7
  Bottom 0.406: v38.8,74.7 39.1,74.7 41.7,77.3 | 41.7,77.3 CON3.1 | C27.1 41.2,76.8 41.7,77.3
PF4
  Top 0.406: IC1.57 36.87,71.32 JP3.1
PF5
  Top 0.406: IC1.56 34.07,67.4 39.8,67.4 40.6,68.2 40.6,70.21 JP3.5
PF6  (via drill 0.51)
  Top 0.406: IC1.55 34.13,66.35 v34.92,66.35
  Bottom 0.406: v34.92,66.35 35.95,66.35 38.2,68.6 38.2,70.35 JP3.3
PF7
  Top 0.406: IC1.54 34.23,65.34 42.74,65.34 45.8,68.4 45.8,70.33 JP3.9
PG0
  Top 0.254: XLATR1.2 34.97,36.68 31.29,40.36 31.29,44.23 IC1.33
PG1
  Top 0.254: IC1.34 26.31,50.32 25.6,50.32 25.25,49.96 25.25,48.72 30.58,43.38 30.58,40.18 34.73,36.03 XLATR1.3
PG2  (via drill 0.51)
  Top 0.254: IC1.43 33.6,53.05 v33.6,52.81 | v59.21,73.25 62.76,73.25 64.94,75.43 LATCH1.11
  Bottom 0.254: v33.6,52.81 54.05,73.25 v59.21,73.25
PG3
  Top 0.406: IC1.18 15.22,56.35 14.76,56.35 13.49,57.62 13.49,66.91 R1.2
RD
  Top 0.254: FPC1.6 51.7,41.92 45.81,36.03 XLATR1.12
RESET  (via drill 0.71)
  Top 0.254: XLATR1.4 34.49,35.38 25.78,44.09 25.78,45.69 v25.38,46.09
  Top 0.406: R2.2 8.95,53.03 8.95,55.67 9.58,56.3 SPRVSR.6 10.51,56.22 v12.47,56.22 12.88,56.22 13.8,55.3 16.4,55.3 IC1.20
  Bottom 0.406: v25.38,46.09 15.43,56.22 v12.47,56.22 12.47,60.59 19.84,67.96 19.84,70.16 18.6,71.4 18.6,73.42 JP4.5 22.29,72.2 30.4,72.2 31,72.8 42.4,72.8 43.2,72 43.2,71 41.95,69.75 JP3.6
RST_L
  Top 0.254: 61.7,39.65 61.7,39.48 | 61.7,39.65 FPC1.16 | XLATR1.11 57.43,35.38 61.7,39.65
VCC
  pour Top: 0,20 37.5,0 57.5,0 95,20 95,108 88,108 83,100 12,100 7,108 0,108
VDD  (via drill 0.51, 0.6)
  Top 0.406: FPC1.17 62.7,41.94 64.42,40.22 | v62.74,40.1 64.29,40.1 64.42,40.22 | R15.1 47.07,48.83 v47.07,47.97 | 64.42,40.22 64.54,40.1 65.05,40.1 67.08,42.13 74.7,42.13
  Top 0.61: R3.1 76.23,40.6 74.7,42.13 74.7,46.19 75.97,47.46 D1.C 76.48,47.85 76.48,54.57 77.75,55.84 C1.+
  Bottom 0.406: v47.07,47.97 54.94,40.1 v62.74,40.1
WR
  Top 0.254: FPC1.5 50.7,42.17 45.22,36.68 XLATR1.13

### Text on the board
tPlace: Driver Interface Module | Generously Sponsored By | Alberta Printed Circuit | (C) 2009/2010 John Hughes | PBR 2010
bPlace: Buttons1 | Buttons2 | Paddles | Uplink